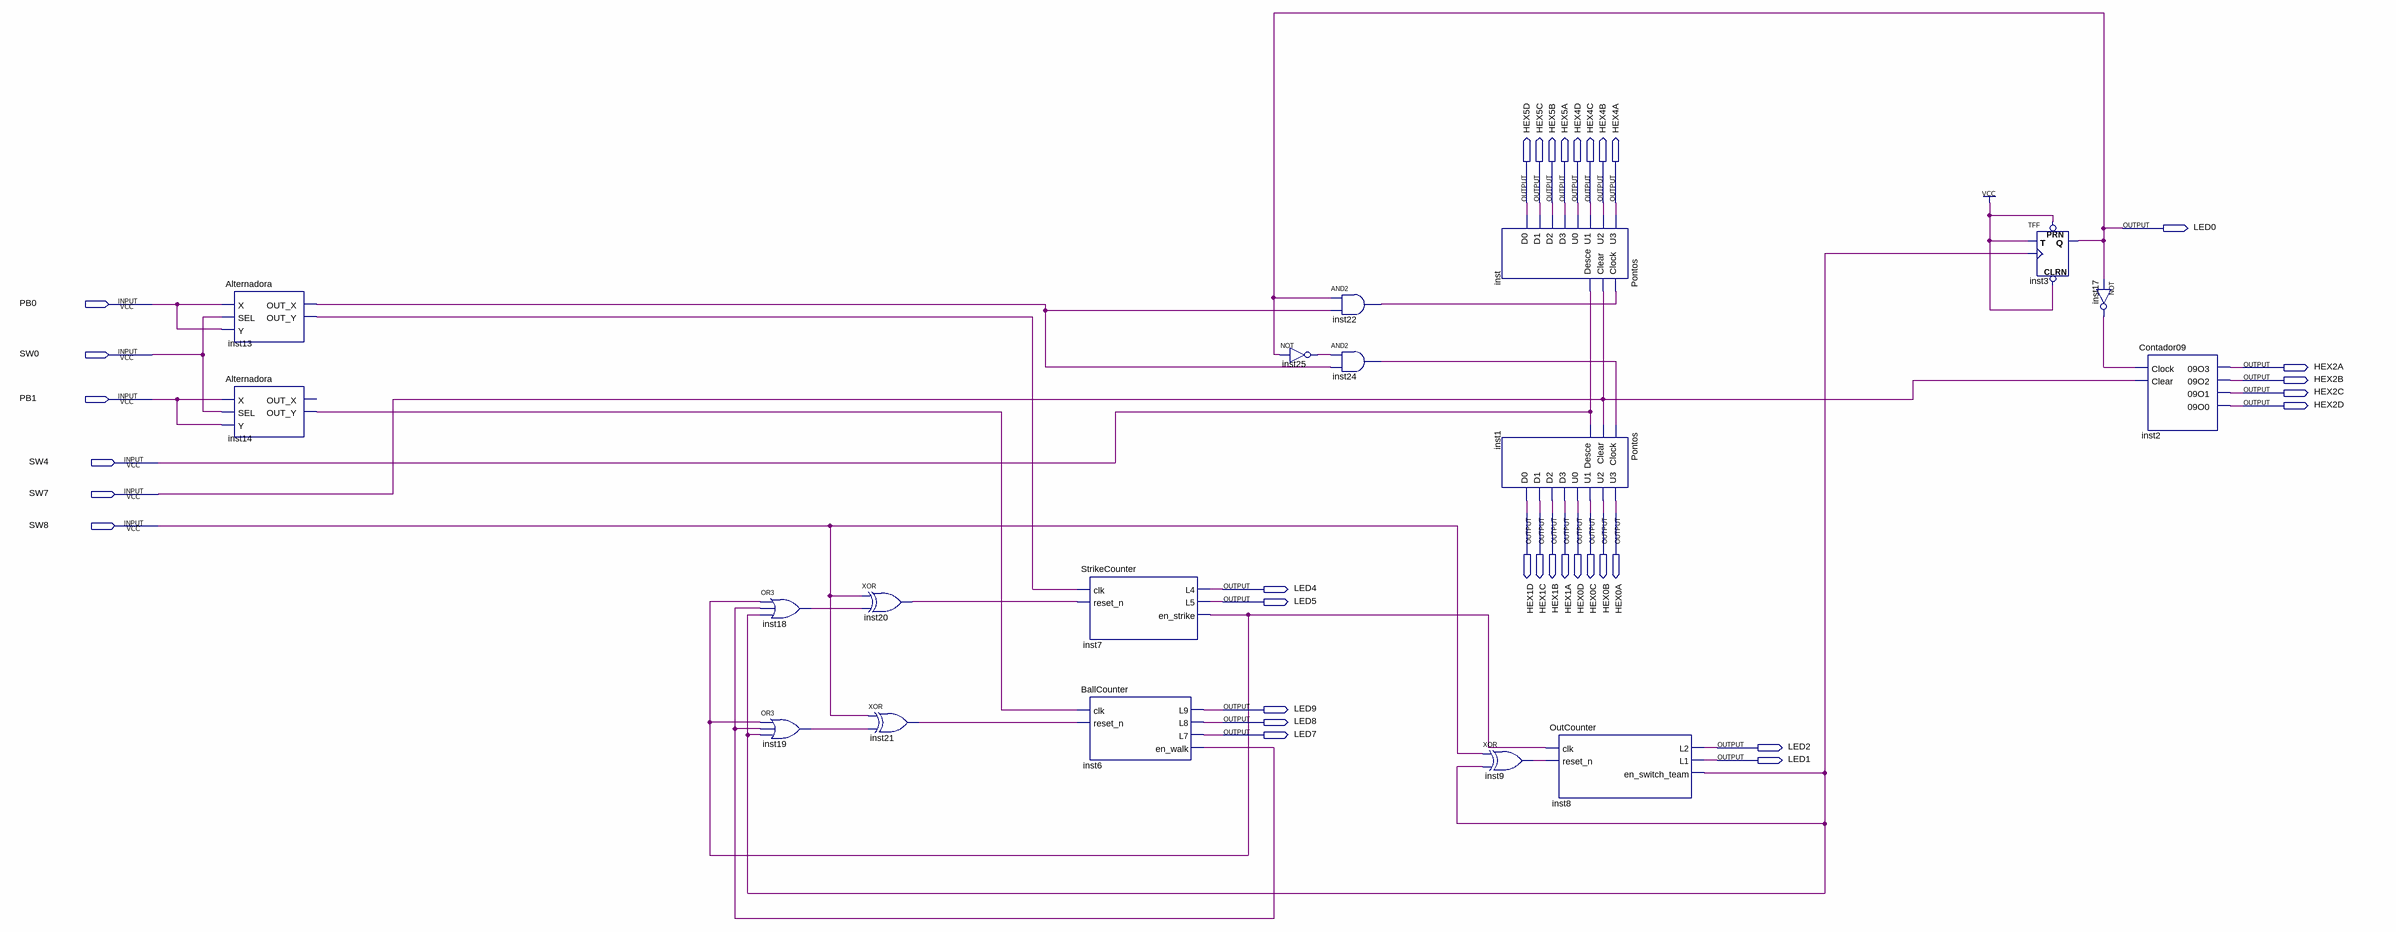
[diagram p0: schematic sheet]
// Quartus schematic PlacarBaseball.bdf as structural Verilog: 18 symbols, 34 pins
module PlacarBaseball (
  input  PB0,
  input  SW0,
  input  PB1,
  input  SW4,
  input  SW7,
  input  SW8,
  output HEX5D,
  output HEX5C,
  output HEX5B,
  output HEX5A,
  output HEX4D,
  output HEX4C,
  output HEX4B,
  output HEX4A,
  output LED0,
  output HEX2A,
  output HEX2B,
  output HEX2C,
  output HEX2D,
  output HEX1D,
  output HEX1C,
  output HEX1B,
  output HEX1A,
  output HEX0D,
  output HEX0C,
  output HEX0B,
  output HEX0A,
  output LED4,
  output LED5,
  output LED9,
  output LED8,
  output LED7,
  output LED2,
  output LED1
);

  wire inst6_en_walk, inst7_en_strike, inst8_en_switch_team, inst9_out, inst13_out_x, inst13_out_y,
       inst14_out_y, inst17_out, inst18_out, inst19_out, inst20_out, inst21_out, inst22_out, inst24_out,
       inst25_out;

  Alternadora inst13 (.X(PB0), .SEL(SW0), .Y(PB0), .OUT_X(inst13_out_x), .OUT_Y(inst13_out_y));
  Alternadora inst14 (.X(PB1), .SEL(SW0), .Y(PB1), .OUT_Y(inst14_out_y));  // open: OUT_X
  or inst18 (inst18_out, inst7_en_strike, inst6_en_walk, inst8_en_switch_team);
  or inst19 (inst19_out, inst7_en_strike, inst6_en_walk, inst8_en_switch_team);
  xor inst20 (inst20_out, SW8, inst18_out);
  xor inst21 (inst21_out, SW8, inst19_out);
  StrikeCounter inst7 (.clk(inst13_out_y), .reset_n(inst20_out), .L4(LED4), .L5(LED5), .en_strike(inst7_en_strike));
  BallCounter inst6 (
    .clk(inst14_out_y), .reset_n(inst21_out), .L9(LED9), .L8(LED8), .L7(LED7), .en_walk(inst6_en_walk));
  not inst25 (inst25_out, LED0);
  and inst22 (inst22_out, LED0, inst13_out_x);
  and inst24 (inst24_out, inst25_out, inst13_out_x);
  Pontos inst (
    .Clock(inst22_out), .Clear(SW7), .Desce(SW4), .U3(HEX4A), .U2(HEX4B), .U1(HEX4C), .U0(HEX4D), .D3(HEX5A),
    .D2(HEX5B), .D1(HEX5C), .D0(HEX5D));
  Pontos inst1 (
    .Clock(inst24_out), .Clear(SW7), .Desce(SW4), .U3(HEX0A), .U2(HEX0B), .U1(HEX0C), .U0(HEX0D), .D3(HEX1A),
    .D2(HEX1B), .D1(HEX1C), .D0(HEX1D));
  xor inst9 (inst9_out, SW8, inst8_en_switch_team);
  OutCounter inst8 (
    .clk(inst7_en_strike), .reset_n(inst9_out), .L2(LED2), .L1(LED1), .en_switch_team(inst8_en_switch_team));
  TFF inst3 (.PRN(1'b1), .CLRN(1'b1), .T(1'b1), .CLK(inst8_en_switch_team), .Q(LED0));
  not inst17 (inst17_out, LED0);
  Contador09 inst2 (.Clock(inst17_out), .Clear(SW7), .\09O3 (HEX2A), .\09O2 (HEX2B), .\09O1 (HEX2C), .\09O0 (HEX2D));
endmodule
